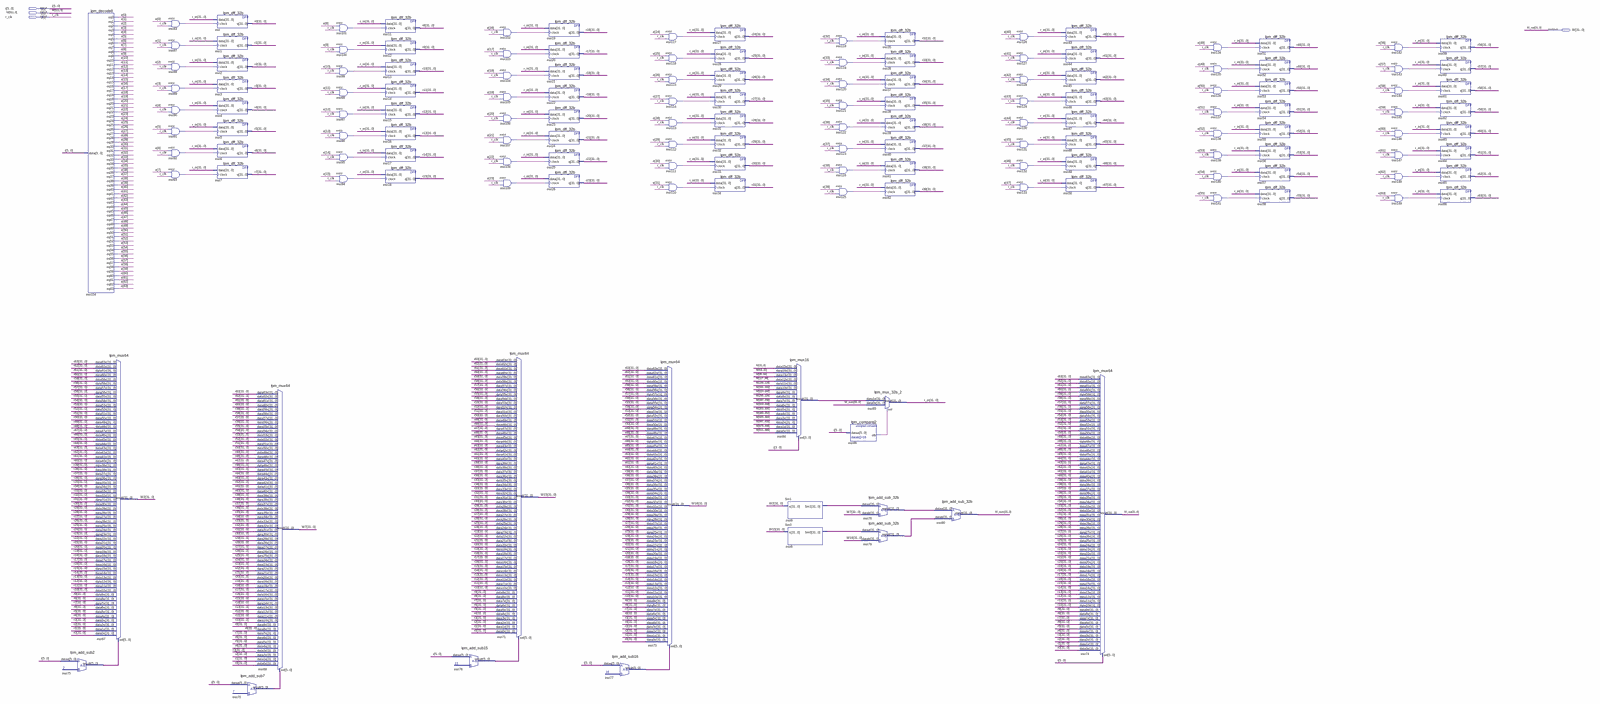
[diagram p0: schematic sheet, whole]
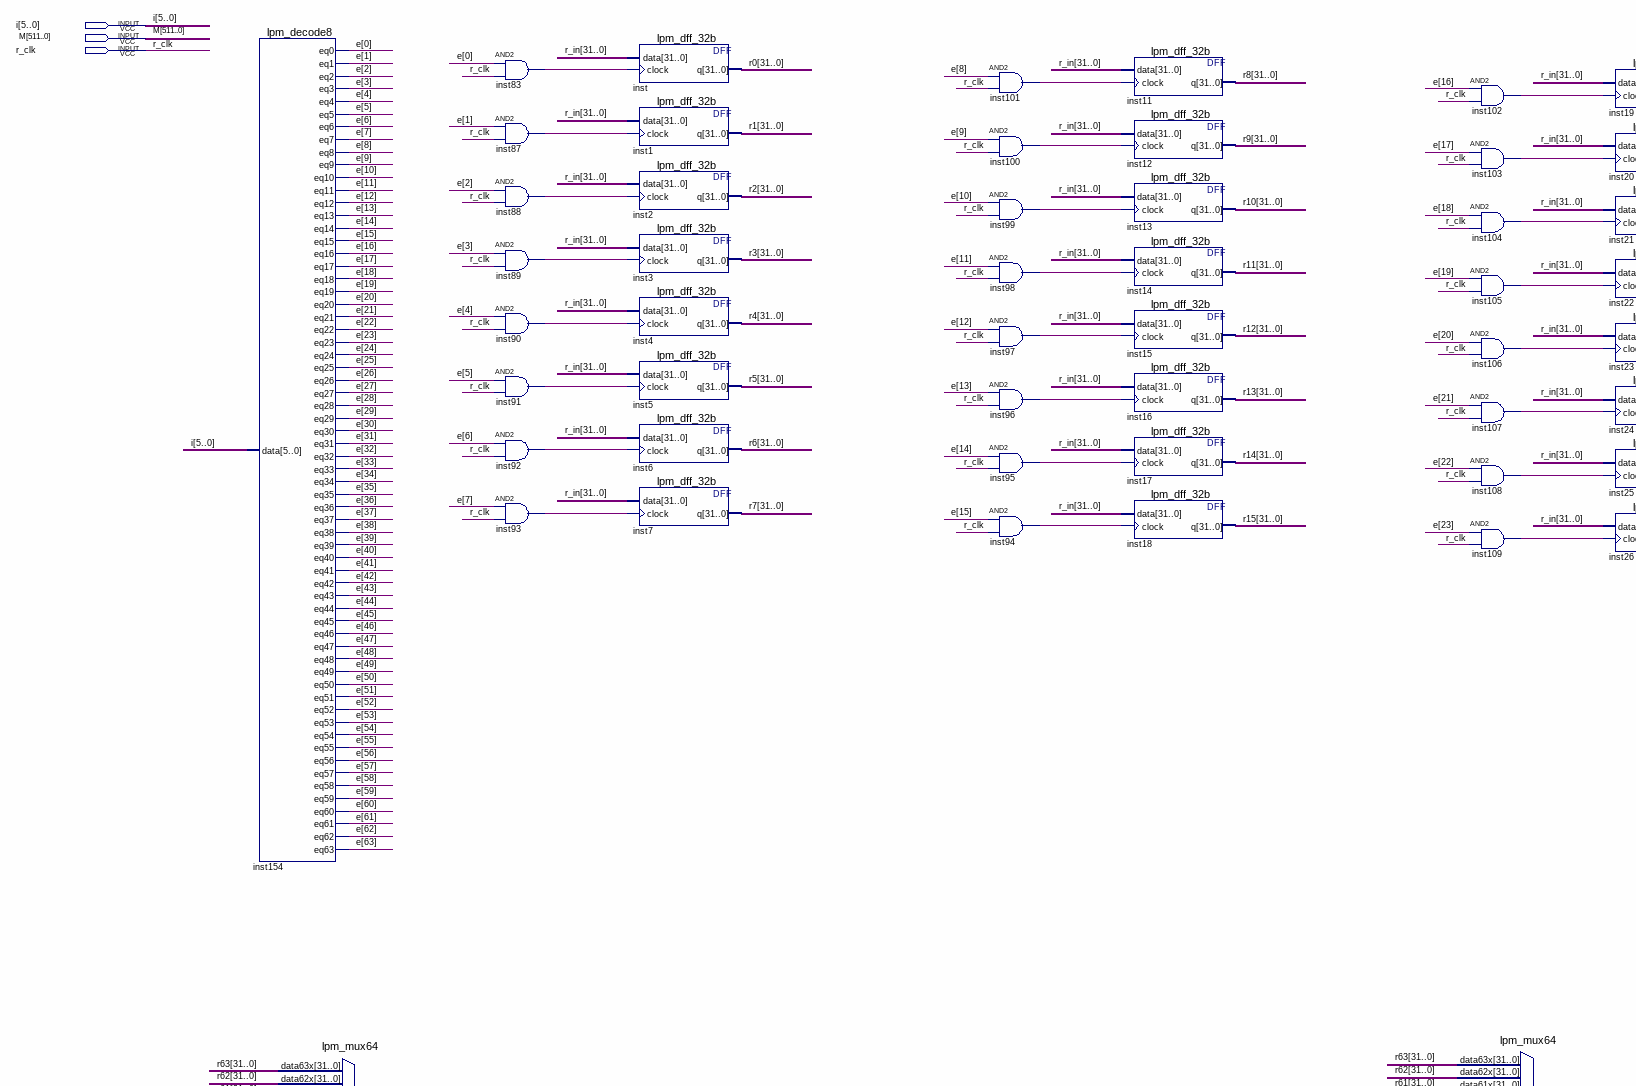
[diagram p1: schematic sheet, upper left part]
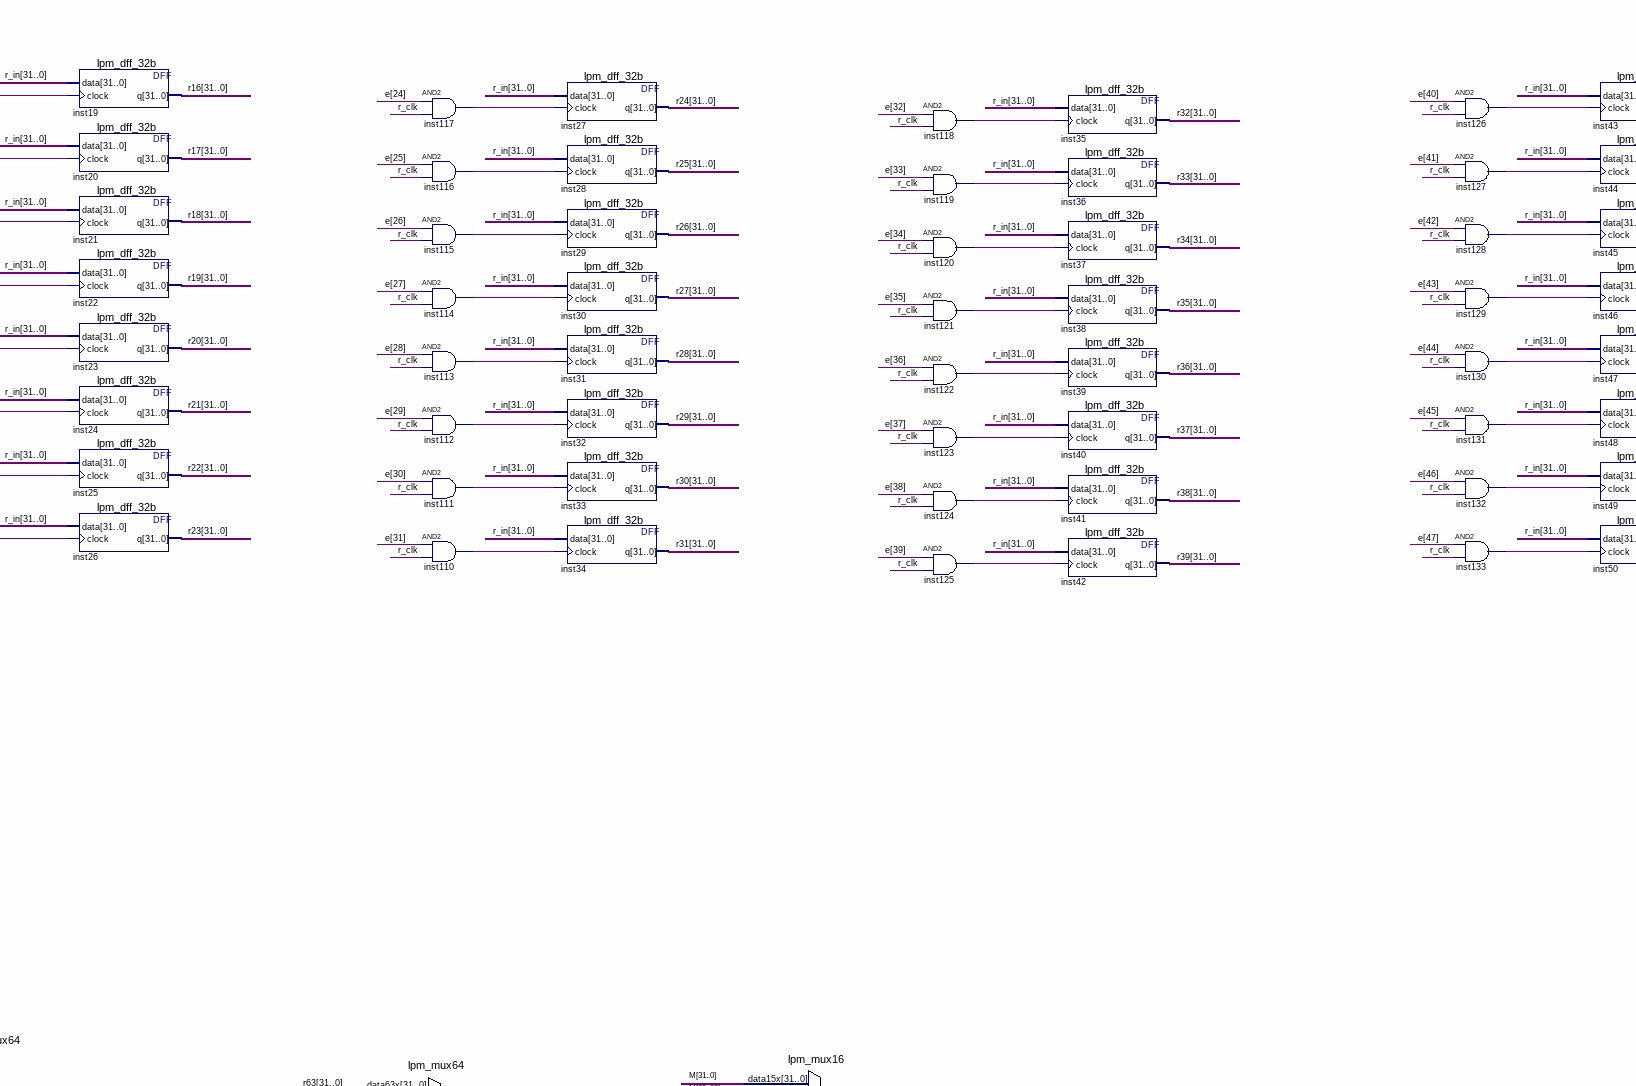
[diagram p2: schematic sheet, upper centre part]
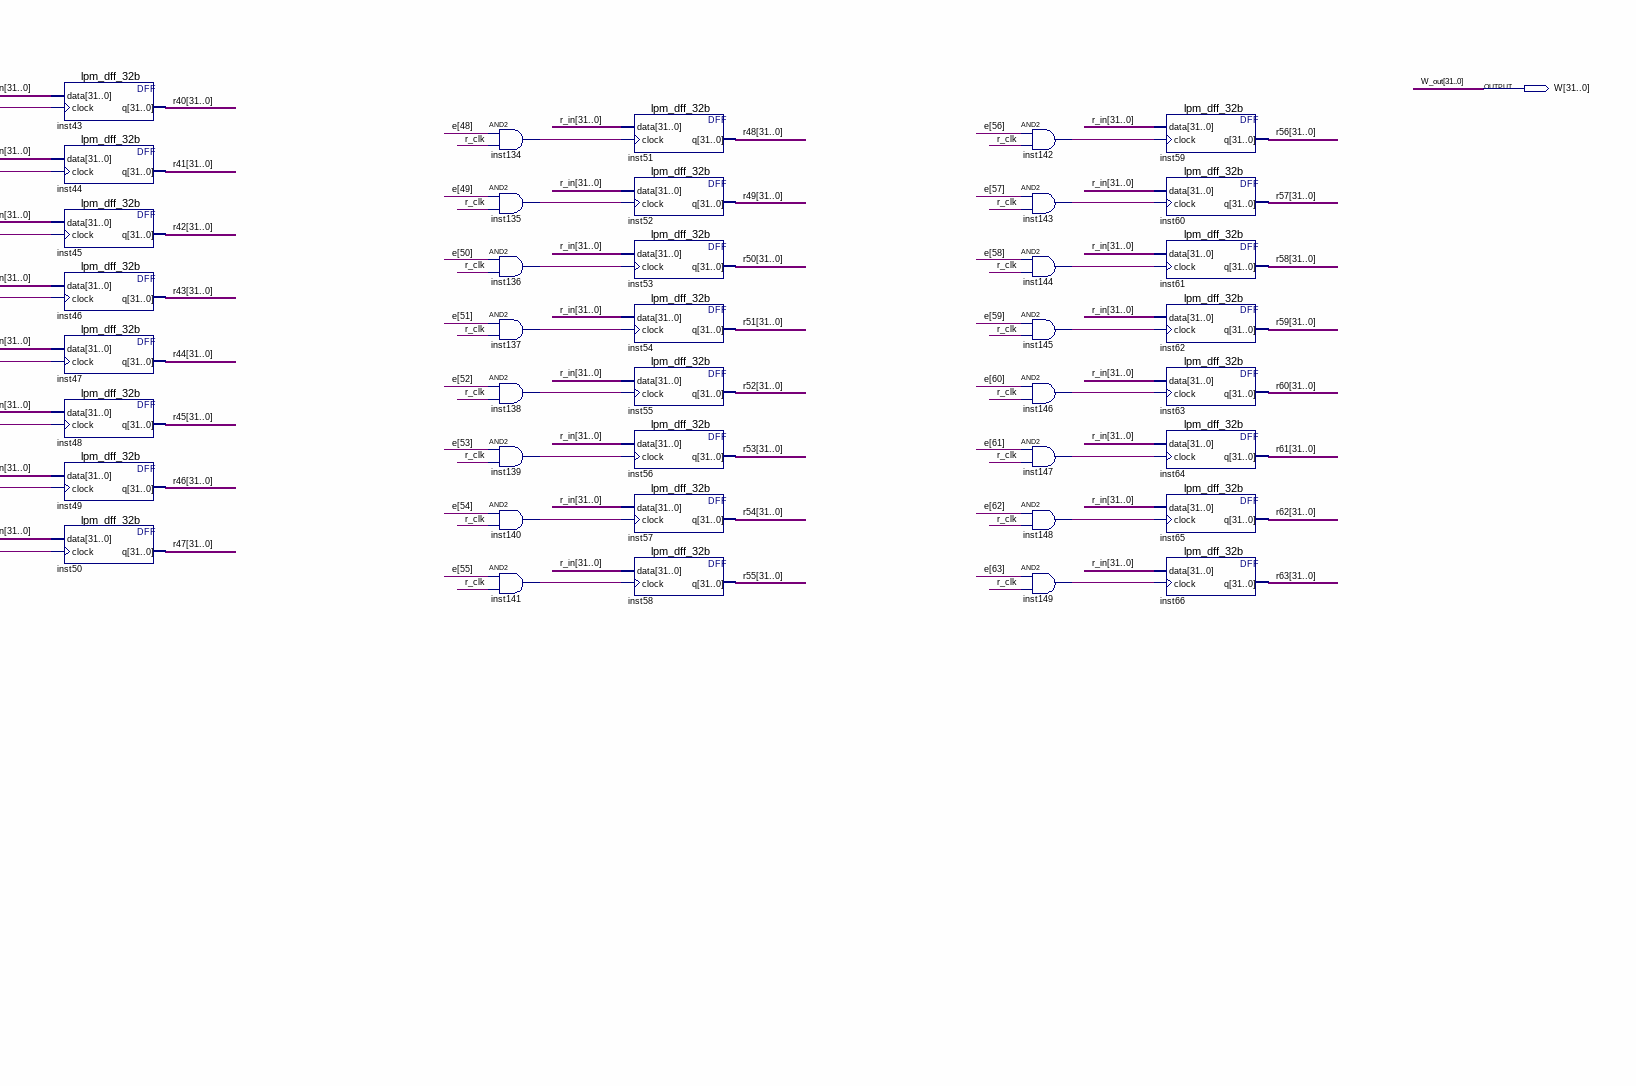
[diagram p3: schematic sheet, upper right part]
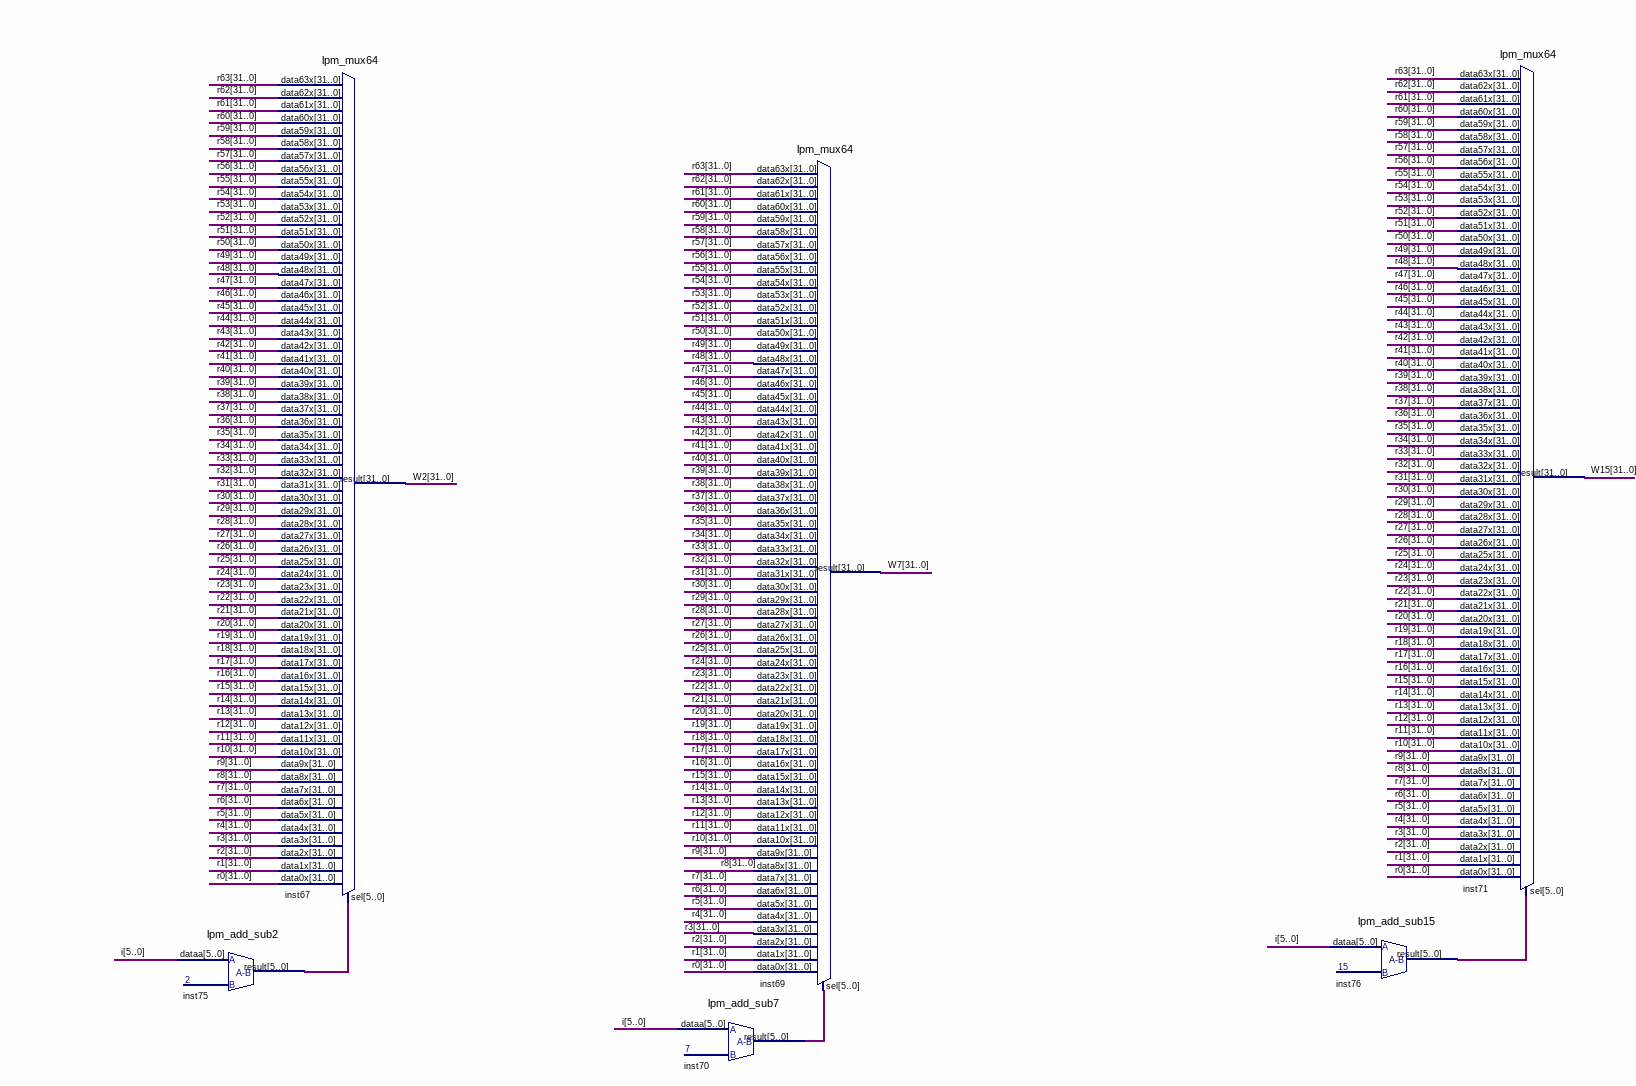
[diagram p4: schematic sheet, lower left part]
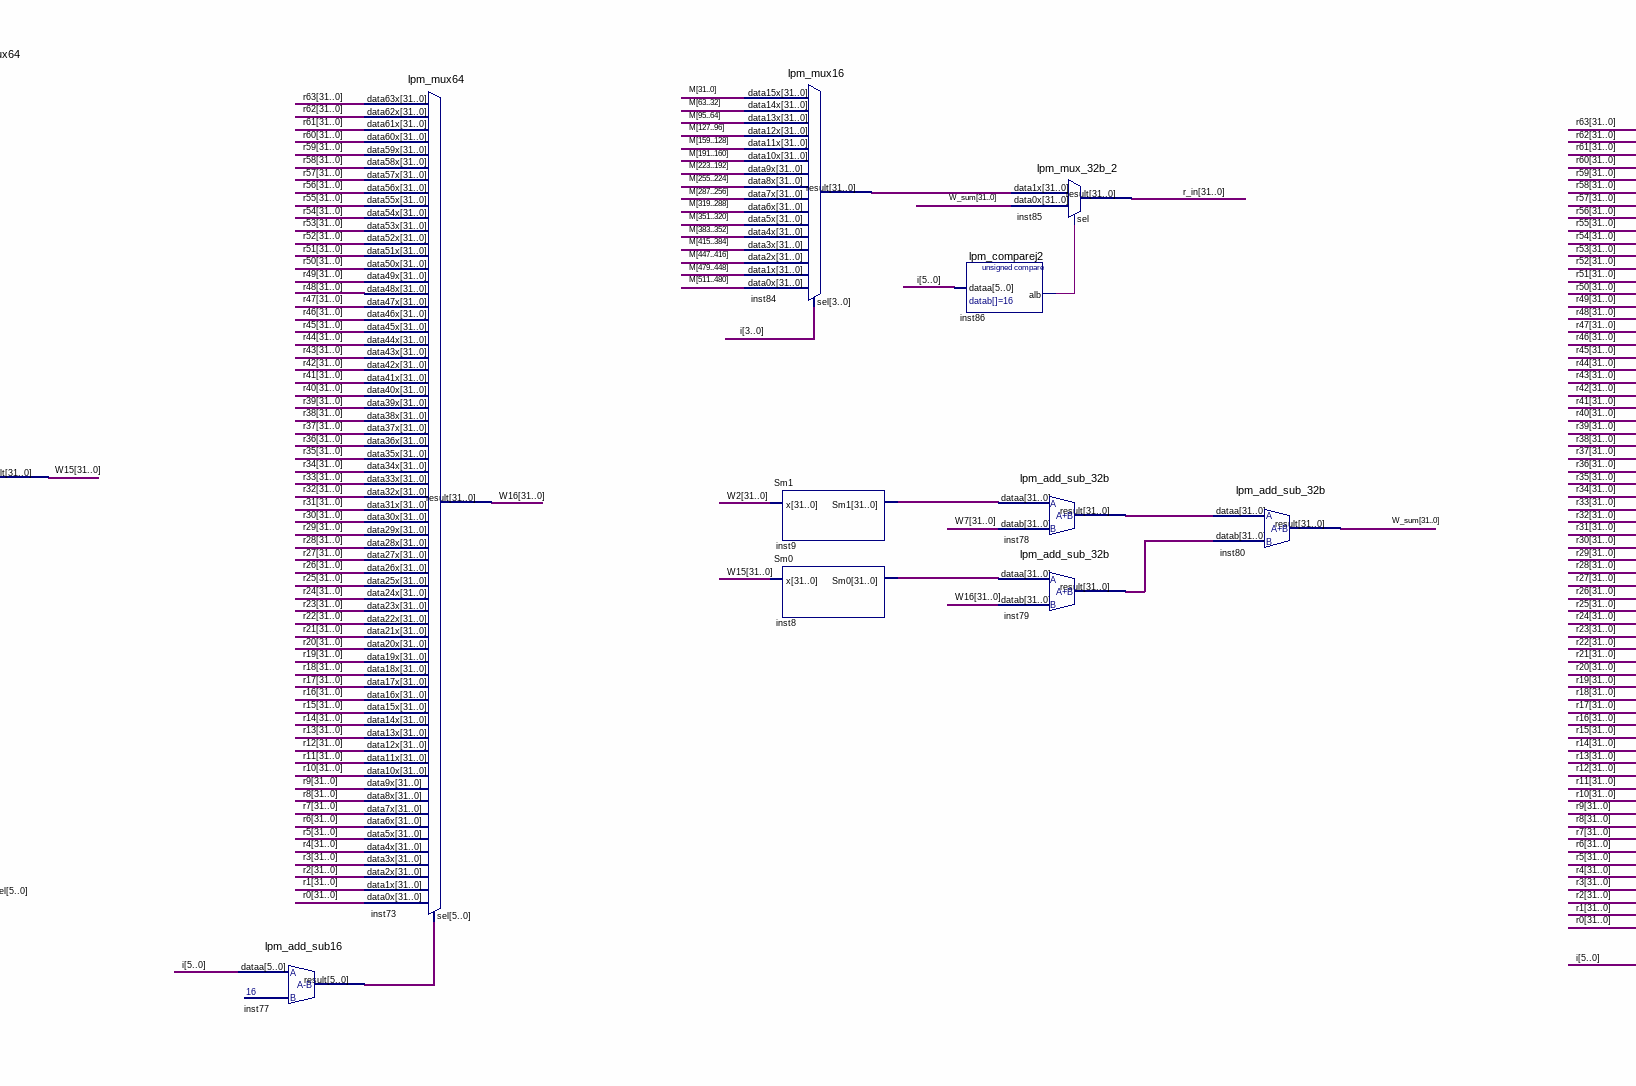
[diagram p5: schematic sheet, lower centre part]
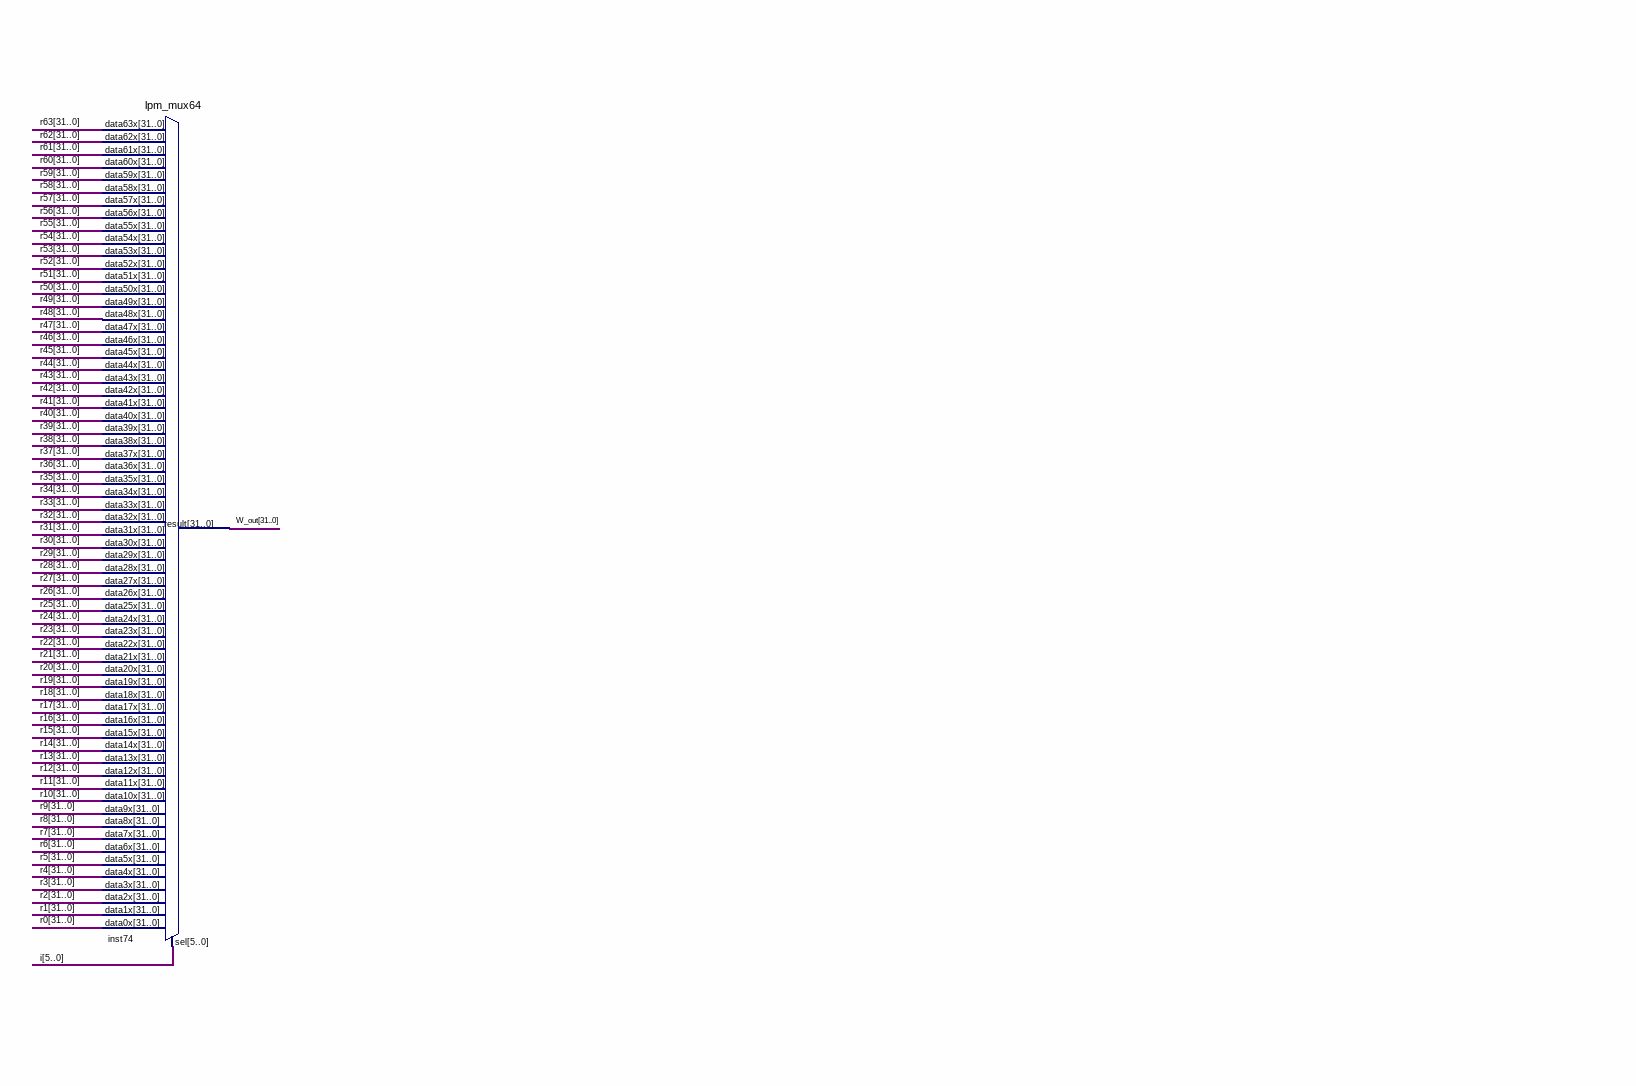
[diagram p6: schematic sheet, lower right part]
// Quartus schematic W.bdf as structural Verilog: 146 symbols, 4 pins
module W (
  input  [5:0] i,
  input  [511:0] M,
  input  r_clk,
  output [31:0] W
);

  wire inst83_out, inst86_alb, inst87_out, inst88_out, inst89_out, inst90_out, inst91_out, inst92_out,
       inst93_out, inst94_out, inst95_out, inst96_out, inst97_out, inst98_out, inst99_out, inst100_out,
       inst101_out, inst102_out, inst103_out, inst104_out, inst105_out, inst106_out, inst107_out,
       inst108_out, inst109_out, inst110_out, inst111_out, inst112_out, inst113_out, inst114_out,
       inst115_out, inst116_out, inst117_out, inst118_out, inst119_out, inst120_out, inst121_out,
       inst122_out, inst123_out, inst124_out, inst125_out, inst126_out, inst127_out, inst128_out,
       inst129_out, inst130_out, inst131_out, inst132_out, inst133_out, inst134_out, inst135_out,
       inst136_out, inst137_out, inst138_out, inst139_out, inst140_out, inst141_out, inst142_out,
       inst143_out, inst144_out, inst145_out, inst146_out, inst147_out, inst148_out, inst149_out;
  wire [5:0] inst70_result, inst75_result, inst76_result, inst77_result;
  wire [31:0] inst8_sm0, inst9_sm1, inst78_result, inst79_result, inst84_result, r0, r1, r2, r3, r4, r5, r6,
       r7, r8, r9, r10, r11, r12, r13, r14, r15, r16, r17, r18, r19, r20, r21, r22, r23, r24, r25, r26, r27,
       r28, r29, r30, r31, r32, r33, r34, r35, r36, r37, r38, r39, r40, r41, r42, r43, r44, r45, r46, r47,
       r48, r49, r50, r51, r52, r53, r54, r55, r56, r57, r58, r59, r60, r61, r62, r63, r_in, W2, W7, W15,
       W16, W_sum;
  wire [63:0] e;

  lpm_add_sub2 inst75 (.dataa(i), .result(inst75_result));
  lpm_decode8 inst154 (
    .data(i), .eq0(e[0]), .eq1(e[1]), .eq2(e[2]), .eq3(e[3]), .eq4(e[4]), .eq5(e[5]), .eq6(e[6]), .eq7(e[7]),
    .eq8(e[8]), .eq9(e[9]), .eq10(e[10]), .eq11(e[11]), .eq12(e[12]), .eq13(e[13]), .eq14(e[14]),
    .eq15(e[15]), .eq16(e[16]), .eq17(e[17]), .eq18(e[18]), .eq19(e[19]), .eq20(e[20]), .eq21(e[21]),
    .eq22(e[22]), .eq23(e[23]), .eq24(e[24]), .eq25(e[25]), .eq26(e[26]), .eq27(e[27]), .eq28(e[28]),
    .eq29(e[29]), .eq30(e[30]), .eq31(e[31]), .eq32(e[32]), .eq33(e[33]), .eq34(e[34]), .eq35(e[35]),
    .eq36(e[36]), .eq37(e[37]), .eq38(e[38]), .eq39(e[39]), .eq40(e[40]), .eq41(e[41]), .eq42(e[42]),
    .eq43(e[43]), .eq44(e[44]), .eq45(e[45]), .eq46(e[46]), .eq47(e[47]), .eq48(e[48]), .eq49(e[49]),
    .eq50(e[50]), .eq51(e[51]), .eq52(e[52]), .eq53(e[53]), .eq54(e[54]), .eq55(e[55]), .eq56(e[56]),
    .eq57(e[57]), .eq58(e[58]), .eq59(e[59]), .eq60(e[60]), .eq61(e[61]), .eq62(e[62]), .eq63(e[63]));
  lpm_mux64 inst67 (
    .data63x(r63), .data62x(r62), .data61x(r61), .data60x(r60), .data59x(r59), .data58x(r58), .data57x(r57),
    .data56x(r56), .data55x(r55), .data54x(r54), .data53x(r53), .data52x(r52), .data51x(r51), .data50x(r50),
    .data49x(r49), .data48x(r48), .data47x(r47), .data46x(r46), .data45x(r45), .data44x(r44), .data43x(r43),
    .data42x(r42), .data41x(r41), .data40x(r40), .data39x(r39), .data38x(r38), .data37x(r37), .data36x(r36),
    .data35x(r35), .data34x(r34), .data33x(r33), .data32x(r32), .data31x(r31), .data30x(r30), .data29x(r29),
    .data28x(r28), .data27x(r27), .data26x(r26), .data25x(r25), .data24x(r24), .data23x(r23), .data22x(r22),
    .data21x(r21), .data20x(r20), .data19x(r19), .data18x(r18), .data17x(r17), .data16x(r16), .data15x(r15),
    .data14x(r14), .data13x(r13), .data12x(r12), .data11x(r11), .data10x(r10), .data9x(r9), .data8x(r8),
    .data7x(r7), .data6x(r6), .data5x(r5), .data4x(r4), .data3x(r3), .data2x(r2), .data1x(r1), .data0x(r0),
    .sel(inst75_result), .result(W2));
  and inst83 (inst83_out, e[0], r_clk);
  and inst87 (inst87_out, e[1], r_clk);
  and inst88 (inst88_out, e[2], r_clk);
  and inst89 (inst89_out, e[3], r_clk);
  and inst90 (inst90_out, e[4], r_clk);
  and inst91 (inst91_out, e[5], r_clk);
  and inst92 (inst92_out, e[6], r_clk);
  and inst93 (inst93_out, e[7], r_clk);
  lpm_dff_32b inst (.data(r_in), .clock(inst83_out), .q(r0));
  lpm_dff_32b inst1 (.data(r_in), .clock(inst87_out), .q(r1));
  lpm_dff_32b inst2 (.data(r_in), .clock(inst88_out), .q(r2));
  lpm_dff_32b inst3 (.data(r_in), .clock(inst89_out), .q(r3));
  lpm_dff_32b inst4 (.data(r_in), .clock(inst90_out), .q(r4));
  lpm_dff_32b inst5 (.data(r_in), .clock(inst91_out), .q(r5));
  lpm_dff_32b inst6 (.data(r_in), .clock(inst92_out), .q(r6));
  lpm_dff_32b inst7 (.data(r_in), .clock(inst93_out), .q(r7));
  lpm_add_sub7 inst70 (.dataa(i), .result(inst70_result));
  lpm_mux64 inst69 (
    .data63x(r63), .data62x(r62), .data61x(r61), .data60x(r60), .data59x(r59), .data58x(r58), .data57x(r57),
    .data56x(r56), .data55x(r55), .data54x(r54), .data53x(r53), .data52x(r52), .data51x(r51), .data50x(r50),
    .data49x(r49), .data48x(r48), .data47x(r47), .data46x(r46), .data45x(r45), .data44x(r44), .data43x(r43),
    .data42x(r42), .data41x(r41), .data40x(r40), .data39x(r39), .data38x(r38), .data37x(r37), .data36x(r36),
    .data35x(r35), .data34x(r34), .data33x(r33), .data32x(r32), .data31x(r31), .data30x(r30), .data29x(r29),
    .data28x(r28), .data27x(r27), .data26x(r26), .data25x(r25), .data24x(r24), .data23x(r23), .data22x(r22),
    .data21x(r21), .data20x(r20), .data19x(r19), .data18x(r18), .data17x(r17), .data16x(r16), .data15x(r15),
    .data14x(r14), .data13x(r13), .data12x(r12), .data11x(r11), .data10x(r10), .data9x(r9), .data8x(r8),
    .data7x(r7), .data6x(r6), .data5x(r5), .data4x(r4), .data3x(r3), .data2x(r2), .data1x(r1), .data0x(r0),
    .sel(inst70_result), .result(W7));
  and inst101 (inst101_out, e[8], r_clk);
  and inst100 (inst100_out, e[9], r_clk);
  and inst99 (inst99_out, e[10], r_clk);
  and inst98 (inst98_out, e[11], r_clk);
  and inst97 (inst97_out, e[12], r_clk);
  and inst96 (inst96_out, e[13], r_clk);
  and inst95 (inst95_out, e[14], r_clk);
  and inst94 (inst94_out, e[15], r_clk);
  lpm_dff_32b inst11 (.data(r_in), .clock(inst101_out), .q(r8));
  lpm_dff_32b inst12 (.data(r_in), .clock(inst100_out), .q(r9));
  lpm_dff_32b inst13 (.data(r_in), .clock(inst99_out), .q(r10));
  lpm_dff_32b inst14 (.data(r_in), .clock(inst98_out), .q(r11));
  lpm_dff_32b inst15 (.data(r_in), .clock(inst97_out), .q(r12));
  lpm_dff_32b inst16 (.data(r_in), .clock(inst96_out), .q(r13));
  lpm_dff_32b inst17 (.data(r_in), .clock(inst95_out), .q(r14));
  lpm_dff_32b inst18 (.data(r_in), .clock(inst94_out), .q(r15));
  lpm_add_sub15 inst76 (.dataa(i), .result(inst76_result));
  and inst102 (inst102_out, e[16], r_clk);
  and inst103 (inst103_out, e[17], r_clk);
  and inst104 (inst104_out, e[18], r_clk);
  and inst105 (inst105_out, e[19], r_clk);
  and inst106 (inst106_out, e[20], r_clk);
  and inst107 (inst107_out, e[21], r_clk);
  and inst108 (inst108_out, e[22], r_clk);
  and inst109 (inst109_out, e[23], r_clk);
  lpm_mux64 inst71 (
    .data63x(r63), .data62x(r62), .data61x(r61), .data60x(r60), .data59x(r59), .data58x(r58), .data57x(r57),
    .data56x(r56), .data55x(r55), .data54x(r54), .data53x(r53), .data52x(r52), .data51x(r51), .data50x(r50),
    .data49x(r49), .data48x(r48), .data47x(r47), .data46x(r46), .data45x(r45), .data44x(r44), .data43x(r43),
    .data42x(r42), .data41x(r41), .data40x(r40), .data39x(r39), .data38x(r38), .data37x(r37), .data36x(r36),
    .data35x(r35), .data34x(r34), .data33x(r33), .data32x(r32), .data31x(r31), .data30x(r30), .data29x(r29),
    .data28x(r28), .data27x(r27), .data26x(r26), .data25x(r25), .data24x(r24), .data23x(r23), .data22x(r22),
    .data21x(r21), .data20x(r20), .data19x(r19), .data18x(r18), .data17x(r17), .data16x(r16), .data15x(r15),
    .data14x(r14), .data13x(r13), .data12x(r12), .data11x(r11), .data10x(r10), .data9x(r9), .data8x(r8),
    .data7x(r7), .data6x(r6), .data5x(r5), .data4x(r4), .data3x(r3), .data2x(r2), .data1x(r1), .data0x(r0),
    .sel(inst76_result), .result(W15));
  lpm_dff_32b inst19 (.data(r_in), .clock(inst102_out), .q(r16));
  lpm_dff_32b inst20 (.data(r_in), .clock(inst103_out), .q(r17));
  lpm_dff_32b inst21 (.data(r_in), .clock(inst104_out), .q(r18));
  lpm_dff_32b inst22 (.data(r_in), .clock(inst105_out), .q(r19));
  lpm_dff_32b inst23 (.data(r_in), .clock(inst106_out), .q(r20));
  lpm_dff_32b inst24 (.data(r_in), .clock(inst107_out), .q(r21));
  lpm_dff_32b inst25 (.data(r_in), .clock(inst108_out), .q(r22));
  lpm_dff_32b inst26 (.data(r_in), .clock(inst109_out), .q(r23));
  lpm_add_sub16 inst77 (.dataa(i), .result(inst77_result));
  lpm_mux64 inst73 (
    .data63x(r63), .data62x(r62), .data61x(r61), .data60x(r60), .data59x(r59), .data58x(r58), .data57x(r57),
    .data56x(r56), .data55x(r55), .data54x(r54), .data53x(r53), .data52x(r52), .data51x(r51), .data50x(r50),
    .data49x(r49), .data48x(r48), .data47x(r47), .data46x(r46), .data45x(r45), .data44x(r44), .data43x(r43),
    .data42x(r42), .data41x(r41), .data40x(r40), .data39x(r39), .data38x(r38), .data37x(r37), .data36x(r36),
    .data35x(r35), .data34x(r34), .data33x(r33), .data32x(r32), .data31x(r31), .data30x(r30), .data29x(r29),
    .data28x(r28), .data27x(r27), .data26x(r26), .data25x(r25), .data24x(r24), .data23x(r23), .data22x(r22),
    .data21x(r21), .data20x(r20), .data19x(r19), .data18x(r18), .data17x(r17), .data16x(r16), .data15x(r15),
    .data14x(r14), .data13x(r13), .data12x(r12), .data11x(r11), .data10x(r10), .data9x(r9), .data8x(r8),
    .data7x(r7), .data6x(r6), .data5x(r5), .data4x(r4), .data3x(r3), .data2x(r2), .data1x(r1), .data0x(r0),
    .sel(inst77_result), .result(W16));
  and inst117 (inst117_out, e[24], r_clk);
  and inst116 (inst116_out, e[25], r_clk);
  and inst115 (inst115_out, e[26], r_clk);
  and inst114 (inst114_out, e[27], r_clk);
  and inst113 (inst113_out, e[28], r_clk);
  and inst112 (inst112_out, e[29], r_clk);
  and inst111 (inst111_out, e[30], r_clk);
  and inst110 (inst110_out, e[31], r_clk);
  lpm_dff_32b inst27 (.data(r_in), .clock(inst117_out), .q(r24));
  lpm_dff_32b inst28 (.data(r_in), .clock(inst116_out), .q(r25));
  lpm_dff_32b inst29 (.data(r_in), .clock(inst115_out), .q(r26));
  lpm_dff_32b inst30 (.data(r_in), .clock(inst114_out), .q(r27));
  lpm_dff_32b inst31 (.data(r_in), .clock(inst113_out), .q(r28));
  lpm_dff_32b inst32 (.data(r_in), .clock(inst112_out), .q(r29));
  lpm_dff_32b inst33 (.data(r_in), .clock(inst111_out), .q(r30));
  lpm_dff_32b inst34 (.data(r_in), .clock(inst110_out), .q(r31));
  lpm_mux16 inst84 (
    .data15x(M[31:0]), .data14x(M[63:32]), .data13x(M[95:64]), .data12x(M[127:96]), .data11x(M[159:128]),
    .data10x(M[191:160]), .data9x(M[223:192]), .data8x(M[255:224]), .data7x(M[287:256]), .data6x(M[319:288]),
    .data5x(M[351:320]), .data4x(M[383:352]), .data3x(M[415:384]), .data2x(M[447:416]), .data1x(M[479:448]),
    .data0x(M[511:480]), .sel(i[3:0]), .result(inst84_result));
  Sm1 inst9 (.x(W2), .Sm1(inst9_sm1));
  Sm0 inst8 (.x(W15), .Sm0(inst8_sm0));
  and inst118 (inst118_out, e[32], r_clk);
  and inst119 (inst119_out, e[33], r_clk);
  and inst120 (inst120_out, e[34], r_clk);
  and inst121 (inst121_out, e[35], r_clk);
  and inst122 (inst122_out, e[36], r_clk);
  and inst123 (inst123_out, e[37], r_clk);
  and inst124 (inst124_out, e[38], r_clk);
  and inst125 (inst125_out, e[39], r_clk);
  lpm_comparej2 inst86 (.dataa(i), .alb(inst86_alb));
  lpm_mux_32b_2 inst85 (.data1x(inst84_result), .data0x(W_sum), .sel(inst86_alb), .result(r_in));
  lpm_add_sub_32b inst78 (.dataa(inst9_sm1), .datab(W7), .result(inst78_result));
  lpm_add_sub_32b inst79 (.dataa(inst8_sm0), .datab(W16), .result(inst79_result));
  lpm_dff_32b inst35 (.data(r_in), .clock(inst118_out), .q(r32));
  lpm_dff_32b inst36 (.data(r_in), .clock(inst119_out), .q(r33));
  lpm_dff_32b inst37 (.data(r_in), .clock(inst120_out), .q(r34));
  lpm_dff_32b inst38 (.data(r_in), .clock(inst121_out), .q(r35));
  lpm_dff_32b inst39 (.data(r_in), .clock(inst122_out), .q(r36));
  lpm_dff_32b inst40 (.data(r_in), .clock(inst123_out), .q(r37));
  lpm_dff_32b inst41 (.data(r_in), .clock(inst124_out), .q(r38));
  lpm_dff_32b inst42 (.data(r_in), .clock(inst125_out), .q(r39));
  lpm_add_sub_32b inst80 (.dataa(inst78_result), .datab(inst79_result), .result(W_sum));
  and inst126 (inst126_out, e[40], r_clk);
  and inst127 (inst127_out, e[41], r_clk);
  and inst128 (inst128_out, e[42], r_clk);
  and inst129 (inst129_out, e[43], r_clk);
  and inst130 (inst130_out, e[44], r_clk);
  and inst131 (inst131_out, e[45], r_clk);
  and inst132 (inst132_out, e[46], r_clk);
  and inst133 (inst133_out, e[47], r_clk);
  lpm_dff_32b inst43 (.data(r_in), .clock(inst126_out), .q(r40));
  lpm_dff_32b inst44 (.data(r_in), .clock(inst127_out), .q(r41));
  lpm_dff_32b inst45 (.data(r_in), .clock(inst128_out), .q(r42));
  lpm_dff_32b inst46 (.data(r_in), .clock(inst129_out), .q(r43));
  lpm_dff_32b inst47 (.data(r_in), .clock(inst130_out), .q(r44));
  lpm_dff_32b inst48 (.data(r_in), .clock(inst131_out), .q(r45));
  lpm_dff_32b inst49 (.data(r_in), .clock(inst132_out), .q(r46));
  lpm_dff_32b inst50 (.data(r_in), .clock(inst133_out), .q(r47));
  lpm_mux64 inst74 (
    .data63x(r63), .data62x(r62), .data61x(r61), .data60x(r60), .data59x(r59), .data58x(r58), .data57x(r57),
    .data56x(r56), .data55x(r55), .data54x(r54), .data53x(r53), .data52x(r52), .data51x(r51), .data50x(r50),
    .data49x(r49), .data48x(r48), .data47x(r47), .data46x(r46), .data45x(r45), .data44x(r44), .data43x(r43),
    .data42x(r42), .data41x(r41), .data40x(r40), .data39x(r39), .data38x(r38), .data37x(r37), .data36x(r36),
    .data35x(r35), .data34x(r34), .data33x(r33), .data32x(r32), .data31x(r31), .data30x(r30), .data29x(r29),
    .data28x(r28), .data27x(r27), .data26x(r26), .data25x(r25), .data24x(r24), .data23x(r23), .data22x(r22),
    .data21x(r21), .data20x(r20), .data19x(r19), .data18x(r18), .data17x(r17), .data16x(r16), .data15x(r15),
    .data14x(r14), .data13x(r13), .data12x(r12), .data11x(r11), .data10x(r10), .data9x(r9), .data8x(r8),
    .data7x(r7), .data6x(r6), .data5x(r5), .data4x(r4), .data3x(r3), .data2x(r2), .data1x(r1), .data0x(r0),
    .sel(i), .result(W));
  and inst134 (inst134_out, e[48], r_clk);
  and inst135 (inst135_out, e[49], r_clk);
  and inst136 (inst136_out, e[50], r_clk);
  and inst137 (inst137_out, e[51], r_clk);
  and inst138 (inst138_out, e[52], r_clk);
  and inst139 (inst139_out, e[53], r_clk);
  and inst140 (inst140_out, e[54], r_clk);
  and inst141 (inst141_out, e[55], r_clk);
  lpm_dff_32b inst51 (.data(r_in), .clock(inst134_out), .q(r48));
  lpm_dff_32b inst52 (.data(r_in), .clock(inst135_out), .q(r49));
  lpm_dff_32b inst53 (.data(r_in), .clock(inst136_out), .q(r50));
  lpm_dff_32b inst54 (.data(r_in), .clock(inst137_out), .q(r51));
  lpm_dff_32b inst55 (.data(r_in), .clock(inst138_out), .q(r52));
  lpm_dff_32b inst56 (.data(r_in), .clock(inst139_out), .q(r53));
  lpm_dff_32b inst57 (.data(r_in), .clock(inst140_out), .q(r54));
  lpm_dff_32b inst58 (.data(r_in), .clock(inst141_out), .q(r55));
  and inst142 (inst142_out, e[56], r_clk);
  and inst143 (inst143_out, e[57], r_clk);
  and inst144 (inst144_out, e[58], r_clk);
  and inst145 (inst145_out, e[59], r_clk);
  and inst146 (inst146_out, e[60], r_clk);
  and inst147 (inst147_out, e[61], r_clk);
  and inst148 (inst148_out, e[62], r_clk);
  and inst149 (inst149_out, e[63], r_clk);
  lpm_dff_32b inst59 (.data(r_in), .clock(inst142_out), .q(r56));
  lpm_dff_32b inst60 (.data(r_in), .clock(inst143_out), .q(r57));
  lpm_dff_32b inst61 (.data(r_in), .clock(inst144_out), .q(r58));
  lpm_dff_32b inst62 (.data(r_in), .clock(inst145_out), .q(r59));
  lpm_dff_32b inst63 (.data(r_in), .clock(inst146_out), .q(r60));
  lpm_dff_32b inst64 (.data(r_in), .clock(inst147_out), .q(r61));
  lpm_dff_32b inst65 (.data(r_in), .clock(inst148_out), .q(r62));
  lpm_dff_32b inst66 (.data(r_in), .clock(inst149_out), .q(r63));

  // Other names for the same wires on the sheet: W_out[31:0] = W
endmodule
